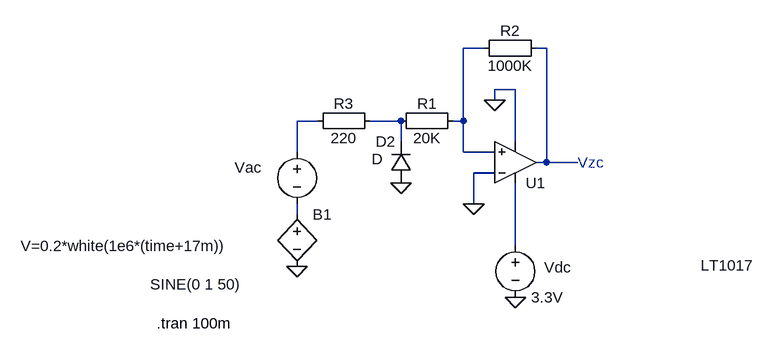
[diagram p0: schematic zcd3.asc]
zcd3.asc, the LTspice schematic file:
Version 4
SHEET 1 880 680
WIRE 96 -32 64 -32
WIRE 192 -32 176 -32
WIRE 144 32 112 32
WIRE 112 48 112 32
WIRE -160 80 -192 80
WIRE -32 80 -80 80
WIRE 64 80 64 -32
WIRE 64 80 48 80
WIRE -32 112 -32 80
WIRE 144 112 144 32
WIRE -192 128 -192 80
WIRE 64 128 64 80
WIRE 112 128 64 128
WIRE 192 144 192 -32
WIRE 192 144 176 144
WIRE 240 144 192 144
WIRE 112 160 80 160
WIRE 80 208 80 160
WIRE -192 224 -192 208
WIRE 144 272 144 176
FLAG -192 304 0
FLAG 144 352 0
FLAG 80 208 0
FLAG 112 48 0
FLAG -32 176 0
SYMBOL Comparators\\LT1017 144 144 M180
WINDOW 3 285 -159 Left 2
SYMATTR InstName U1
SYMBOL voltage -192 112 R0
WINDOW 0 -96 40 Left 2
WINDOW 3 -226 220 Left 2
WINDOW 123 0 0 Left 0
WINDOW 39 0 0 Left 0
SYMATTR InstName Vac
SYMATTR Value SINE(0 1 50)
SYMBOL voltage 144 256 R0
WINDOW 0 44 50 Left 2
WINDOW 123 0 0 Left 0
WINDOW 39 0 0 Left 0
SYMATTR InstName Vdc
SYMATTR Value 3.3V
SYMBOL bv -192 208 R0
WINDOW 3 -425 65 Left 2
SYMATTR InstName B1
SYMATTR Value V=0.2*white(1e6*(time+17m))
SYMBOL Misc\\EuropeanResistor 64 64 R90
WINDOW 0 5 56 VBottom 2
WINDOW 3 27 56 VTop 2
SYMATTR InstName R1
SYMATTR Value 20K
SYMBOL Misc\\EuropeanResistor 192 -48 R90
WINDOW 0 5 56 VBottom 2
WINDOW 3 27 56 VTop 2
SYMATTR InstName R2
SYMATTR Value 1000K
SYMBOL diode -16 176 R180
WINDOW 0 24 64 Left 2
WINDOW 3 44 37 Left 2
SYMATTR InstName D2
SYMBOL Misc\\EuropeanResistor -64 64 R90
WINDOW 0 5 56 VBottom 2
WINDOW 3 27 56 VTop 2
SYMATTR InstName R3
SYMATTR Value 220
TEXT -408 392 Left 2 !.tran 100m
TEXT 240 144 Left 2 ;Vzc

The netlist it stands for:
* zcd3.asc
XU1 N001 0 N006 0 N002 LT1017  ; pins In+ In- V+ V- OUT
Vac N003 N005 SINE(0 1 50)
Vdc N006 0 3.3V
B1 N005 0 V=0.2*white(1e6*(time+17m))
R1 N001 N004 20K
R2 N002 N001 1000K
D2 0 N004 D
R3 N004 N003 220
.model D D
.lib standard.dio
.tran 100m
* Vzc
.backanno
.end